# Altium schematic sheet Top.SchDoc
size 406 x 304 mm; SheetNumber: 1; SheetTotal: 6
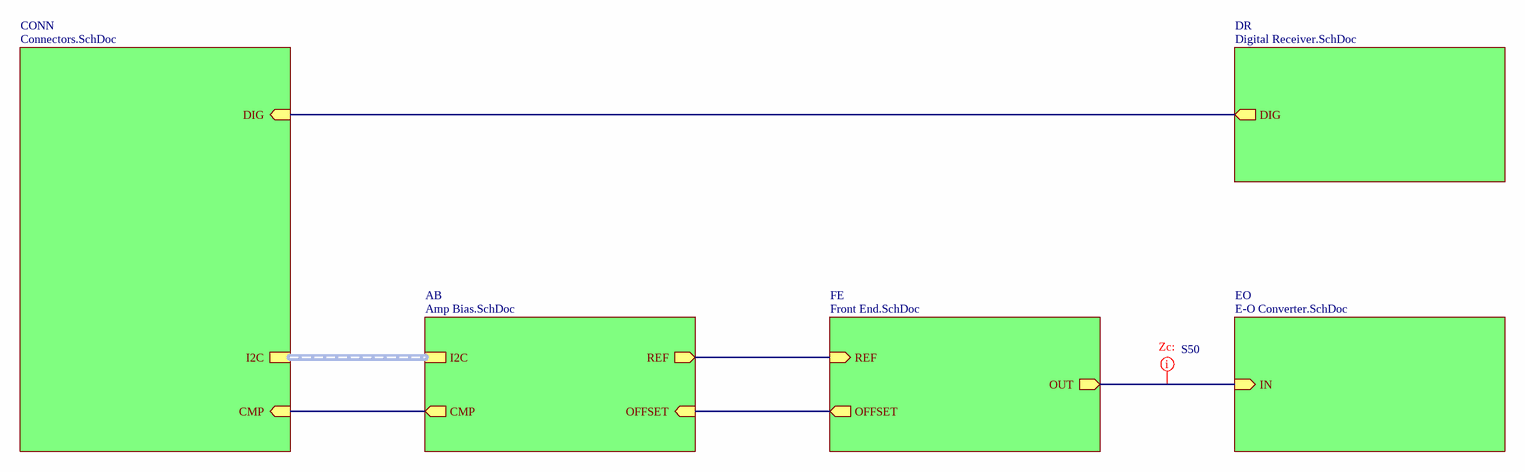
[diagram p0: Top.SchDoc]

## Sub-sheets
AB = Amp Bias.SchDoc: REF (out), OFFSET (in), I2C (harness I2C), CMP (out)
CONN = Connectors.SchDoc: I2C (harness I2C), CMP (in), DIG (in)
DR = Digital Receiver.SchDoc: DIG (out)
EO = E-O Converter.SchDoc: IN (in)
FE = Front End.SchDoc: OUT (out), REF (in), OFFSET (out)

## Nets
(unnamed): sheet CONN/CMP, sheet AB/CMP
(unnamed): sheet CONN/DIG, sheet DR/DIG
(unnamed): sheet AB/REF, sheet FE/REF
(unnamed): sheet AB/OFFSET, sheet FE/OFFSET
(unnamed): sheet FE/OUT, sheet EO/IN

## Buses and harness runs
harness sheet AB/I2C = sheet CONN/I2C

## Layout directives
net class S50: (no net found under the mark)

## Notes on the sheet
- Rev
- Sheet Name:
- Date:
- Sheet
- Designer:
- of